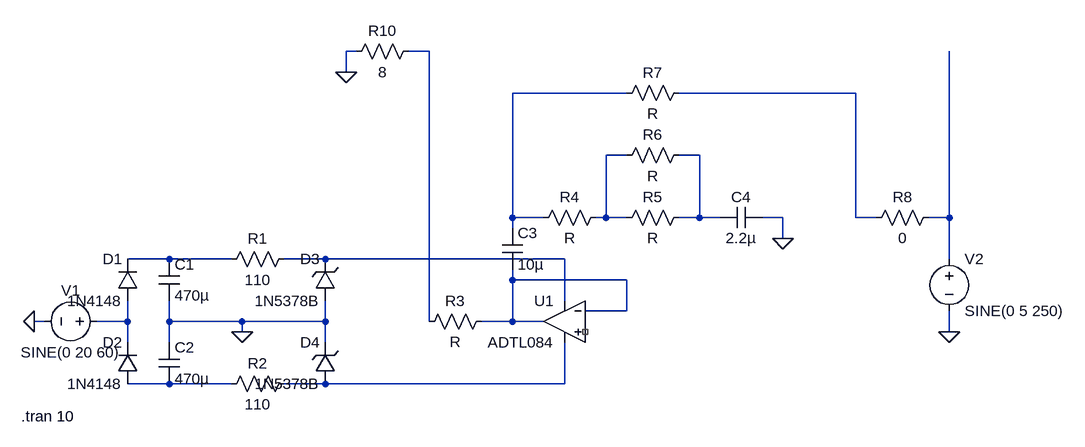
[diagram p0: schematic U4-Filter-Board.asc]
U4-Filter-Board.asc, the LTspice schematic file:
Version 4
SHEET 1 1568 680
WIRE 480 -496 464 -496
WIRE 592 -496 560 -496
WIRE 464 -464 464 -496
WIRE 896 -432 720 -432
WIRE 1248 -432 976 -432
WIRE 896 -336 864 -336
WIRE 1008 -336 976 -336
WIRE 720 -240 720 -432
WIRE 768 -240 720 -240
WIRE 864 -240 864 -336
WIRE 864 -240 848 -240
WIRE 896 -240 864 -240
WIRE 1008 -240 1008 -336
WIRE 1008 -240 976 -240
WIRE 1040 -240 1008 -240
WIRE 1136 -240 1104 -240
WIRE 1248 -240 1248 -432
WIRE 1280 -240 1248 -240
WIRE 1392 -240 1392 -496
WIRE 1392 -240 1360 -240
WIRE 720 -224 720 -240
WIRE 1136 -208 1136 -240
WIRE 192 -176 128 -176
WIRE 288 -176 192 -176
WIRE 432 -176 368 -176
WIRE 800 -176 432 -176
WIRE 1392 -176 1392 -240
WIRE 720 -144 720 -160
WIRE 896 -144 720 -144
WIRE 800 -112 800 -176
WIRE 896 -96 896 -144
WIRE 896 -96 832 -96
WIRE 0 -80 -16 -80
WIRE 128 -80 128 -112
WIRE 128 -80 80 -80
WIRE 192 -80 192 -112
WIRE 304 -80 192 -80
WIRE 432 -80 432 -112
WIRE 432 -80 304 -80
WIRE 592 -80 592 -496
WIRE 720 -80 720 -144
WIRE 720 -80 672 -80
WIRE 768 -80 720 -80
WIRE 304 -64 304 -80
WIRE 1392 -64 1392 -96
WIRE 128 -48 128 -80
WIRE 192 -48 192 -80
WIRE 432 -48 432 -80
WIRE 192 16 128 16
WIRE 288 16 192 16
WIRE 432 16 368 16
WIRE 800 16 800 -48
WIRE 800 16 432 16
FLAG -16 -80 0
FLAG 304 -64 0
FLAG 1136 -208 0
FLAG 1392 -64 0
FLAG 464 -464 0
SYMBOL voltage 96 -80 R90
WINDOW 0 -32 56 VBottom 2
WINDOW 3 32 56 VTop 2
WINDOW 123 0 0 Left 0
WINDOW 39 0 0 Left 0
SYMATTR InstName V1
SYMATTR Value SINE(0 20 60)
SYMBOL diode 144 -112 R180
WINDOW 0 24 64 Left 2
WINDOW 3 24 0 Left 2
SYMATTR InstName D1
SYMATTR Value 1N4148
SYMBOL diode 144 16 R180
WINDOW 0 24 64 Left 2
WINDOW 3 24 0 Left 2
SYMATTR InstName D2
SYMATTR Value 1N4148
SYMBOL cap 176 -176 R0
SYMATTR InstName C1
SYMATTR Value 470µ
SYMBOL cap 176 -48 R0
SYMATTR InstName C2
SYMATTR Value 470µ
SYMBOL res 384 -192 R90
WINDOW 0 0 56 VBottom 2
WINDOW 3 32 56 VTop 2
SYMATTR InstName R1
SYMATTR Value 110
SYMBOL res 384 0 R90
WINDOW 0 0 56 VBottom 2
WINDOW 3 32 56 VTop 2
SYMATTR InstName R2
SYMATTR Value 110
SYMBOL zener 448 -112 R180
WINDOW 0 24 64 Left 2
WINDOW 3 24 0 Left 2
SYMATTR InstName D3
SYMATTR Value 1N5378B
SYMATTR Description Diode
SYMATTR Type diode
SYMBOL zener 448 16 R180
WINDOW 0 24 64 Left 2
WINDOW 3 24 0 Left 2
SYMATTR InstName D4
SYMATTR Value 1N5378B
SYMATTR Description Diode
SYMATTR Type diode
SYMBOL Opamps\\ADTL084 800 -144 M0
SYMATTR InstName U1
SYMBOL res 688 -96 R90
WINDOW 0 0 56 VBottom 2
WINDOW 3 32 56 VTop 2
SYMATTR InstName R3
SYMBOL cap 704 -224 R0
SYMATTR InstName C3
SYMATTR Value 10µ
SYMBOL res 864 -256 R90
WINDOW 0 0 56 VBottom 2
WINDOW 3 32 56 VTop 2
SYMATTR InstName R4
SYMBOL res 992 -256 R90
WINDOW 0 0 56 VBottom 2
WINDOW 3 32 56 VTop 2
SYMATTR InstName R5
SYMBOL res 992 -352 R90
WINDOW 0 0 56 VBottom 2
WINDOW 3 32 56 VTop 2
SYMATTR InstName R6
SYMBOL res 992 -448 R90
WINDOW 0 0 56 VBottom 2
WINDOW 3 32 56 VTop 2
SYMATTR InstName R7
SYMBOL cap 1104 -256 R90
WINDOW 0 0 32 VBottom 2
WINDOW 3 32 32 VTop 2
SYMATTR InstName C4
SYMATTR Value 2.2µ
SYMBOL res 1376 -256 R90
WINDOW 0 0 56 VBottom 2
WINDOW 3 32 56 VTop 2
SYMATTR InstName R8
SYMATTR Value 0
SYMBOL voltage 1392 -192 R0
WINDOW 123 0 0 Left 0
WINDOW 39 0 0 Left 0
SYMATTR InstName V2
SYMATTR Value SINE(0 5 250)
SYMBOL res 576 -512 R90
WINDOW 0 0 56 VBottom 2
WINDOW 3 32 56 VTop 2
SYMATTR InstName R10
SYMATTR Value 8
TEXT -36 66 Left 2 !.tran 10

The netlist it stands for:
* U4-Filter-Board.asc
V1 N010 0 SINE(0 20 60)
D1 N010 N007 1N4148
D2 N011 N010 1N4148
C1 N007 0 470µ
C2 0 N011 470µ
R1 N008 N007 110
R2 N012 N011 110
D3 0 N008 1N5378B
D4 N012 0 1N5378B
XU1 NC_01 N009 N008 N012 N009 ADTL084  ; pins In+ In- V+ V- OUT
R3 N009 N001 R
C3 N002 N009 10µ
R4 N004 N002 R
R5 N005 N004 R
R6 N005 N004 R
R7 N003 N002 R
C4 0 N005 2.2µ
R8 N006 N003 0
V2 N006 0 SINE(0 5 250)
R10 N001 0 8
.model D D
.lib standard.dio
.tran 10
.lib ADTL084.lib
.backanno
.end